# Altium schematic sheet PM3_Bosclone_ANALOG_TX_4.SchDoc
size 282 x 200 mm
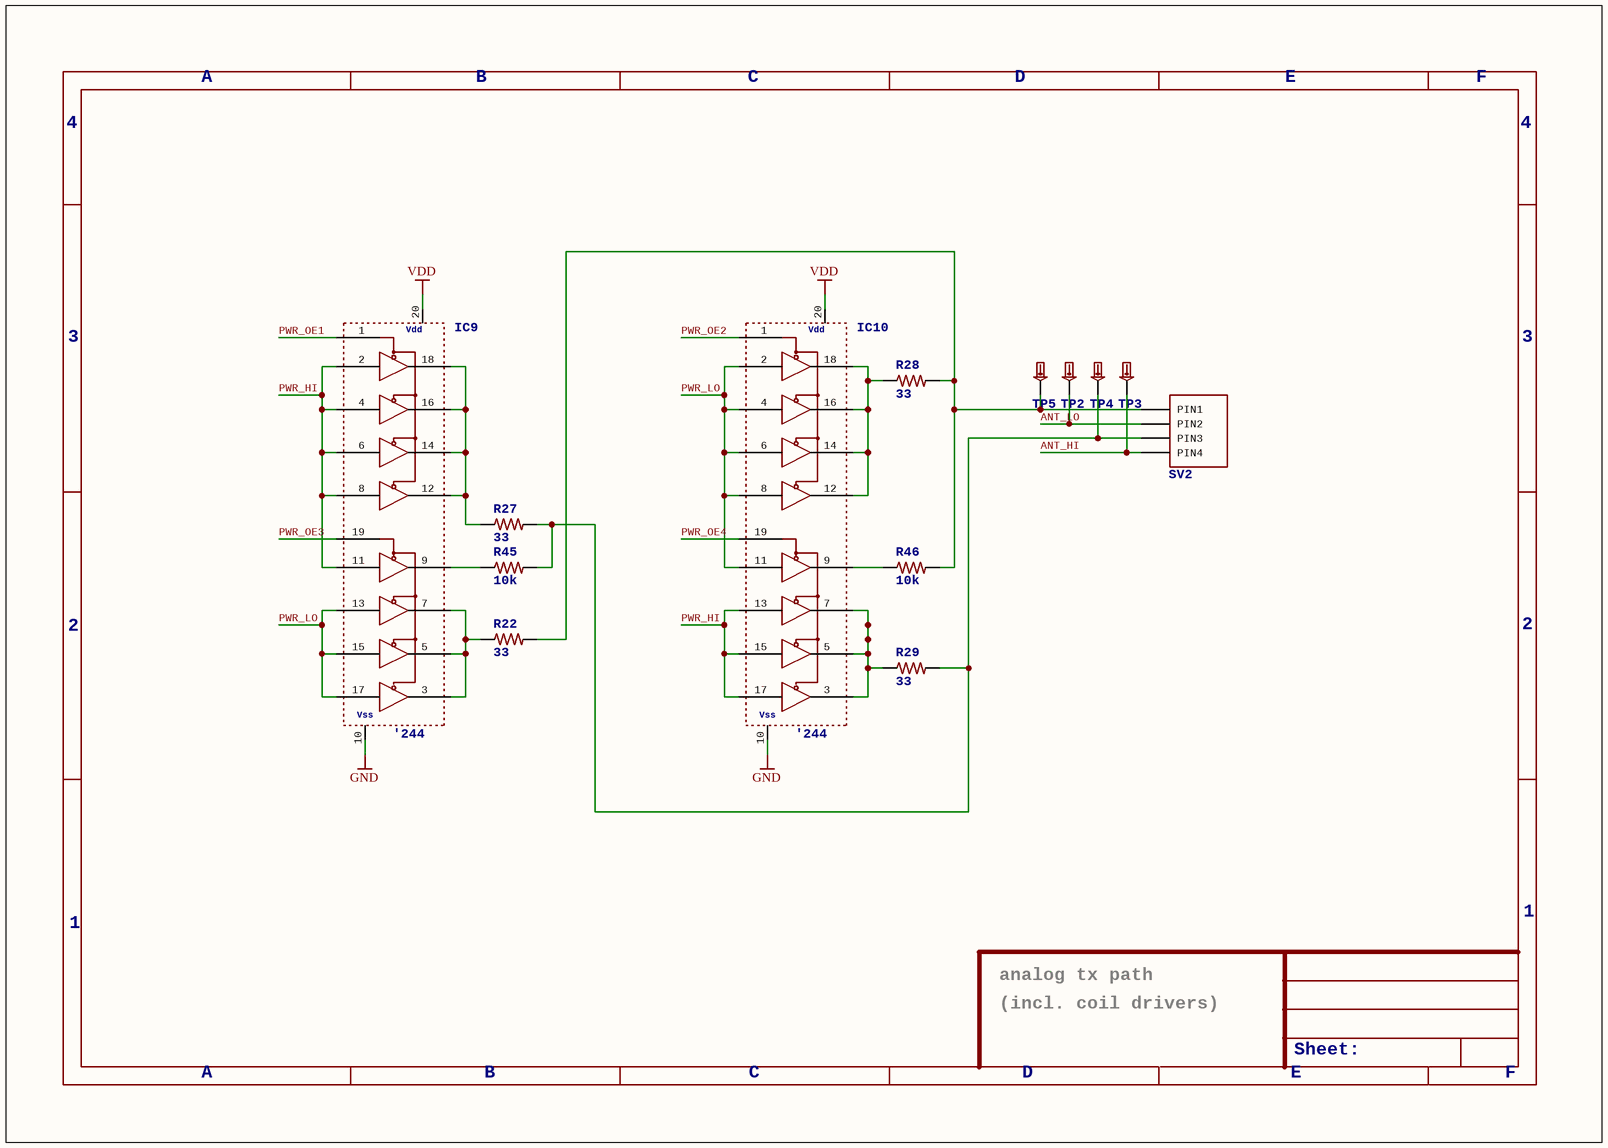
[diagram p0: PM3_Bosclone_ANALOG_TX_4.SchDoc]

## Parts
IC9  74XX244-OCTAL-TRISTATE-BUFFERS  [TSSOP-20-extended]  (value not drawn)
IC10  74XX244-OCTAL-TRISTATE-BUFFERS  [TSSOP-20-extended]  (value not drawn)
R22  33  [RLC_0603]
R27  33  [RLC_0603]
R28  33  [RLC_0603]
R29  33  [RLC_0603]
R45  10k  [RLC_0603]
R46  10k  [RLC_0603]
SV2  HIROSE-MQ172-4POS  [HIROSE-MQ172-4POS]  (value not drawn)
TP2  TESTPADKEYSTONE-SMD  [KEYSTONE-SMD-TESTPOINT-5015]  (value not drawn)
TP3  TESTPADKEYSTONE-SMD  [KEYSTONE-SMD-TESTPOINT-5015]  (value not drawn)
TP4  TESTPADKEYSTONE-SMD  [KEYSTONE-SMD-TESTPOINT-5015]  (value not drawn)
TP5  TESTPADKEYSTONE-SMD  [KEYSTONE-SMD-TESTPOINT-5015]  (value not drawn)

## Nets
GND: IC9.10(VSS) IC10.10(VSS)
VDD: IC9.20(VDD) IC10.20(VDD)
ANT_HI: SV2.4(PIN4) TP3.1(P$1)
ANT_LO: SV2.2(PIN2) TP2.1(P$1)
PWR_HI: IC9.2(1A1) IC9.4(1A2) IC9.6(1A3) IC9.8(1A4) IC9.11(2A1) IC10.13(2A2) IC10.15(2A3) IC10.17(2A4)
PWR_LO: IC9.13(2A2) IC9.15(2A3) IC9.17(2A4) IC10.2(1A1) IC10.4(1A2) IC10.6(1A3) IC10.8(1A4) IC10.11(2A1)
PWR_OE1: IC9.1(1NOE)
PWR_OE2: IC10.1(1NOE)
PWR_OE3: IC9.19(2NOE)
PWR_OE4: IC10.19(2NOE)
NetIC9_3: IC9.3(2Y4) IC9.5(2Y3) IC9.7(2Y2) R22.1
NetIC9_9: IC9.9(2Y1) R45.1
NetIC9_12: IC9.12(1Y4) IC9.14(1Y3) IC9.16(1Y2) IC9.18(1Y1) R27.1
NetIC10_3: IC10.3(2Y4) IC10.5(2Y3) IC10.7(2Y2) R29.1
NetIC10_9: IC10.9(2Y1) R46.1
NetIC10_12: IC10.12(1Y4) IC10.14(1Y3) IC10.16(1Y2) IC10.18(1Y1) R28.1
NetR22_2: R22.2 R28.2 R46.2 SV2.1(PIN1) TP5.1(P$1)
NetR27_2: R27.2 R29.2 R45.2 SV2.3(PIN3) TP4.1(P$1)

## Notes on the sheet
- A
- B
- C
- D
- E
- F
- 4
- 3
- 2
- 1
- analog tx path
- (incl. coil drivers)
- Sheet:

## Library data of the parts
R22 R27-R29 R45 R46 = RESISTOR0603
IC9 IC10 = 74XX244-OCTAL-TRISTATE-BUFFERS: '244: '244; Vdd: Vdd; Vss: Vss